# EAGLE design INA219x4_DoubleWing (EAGLE 9.4.2)
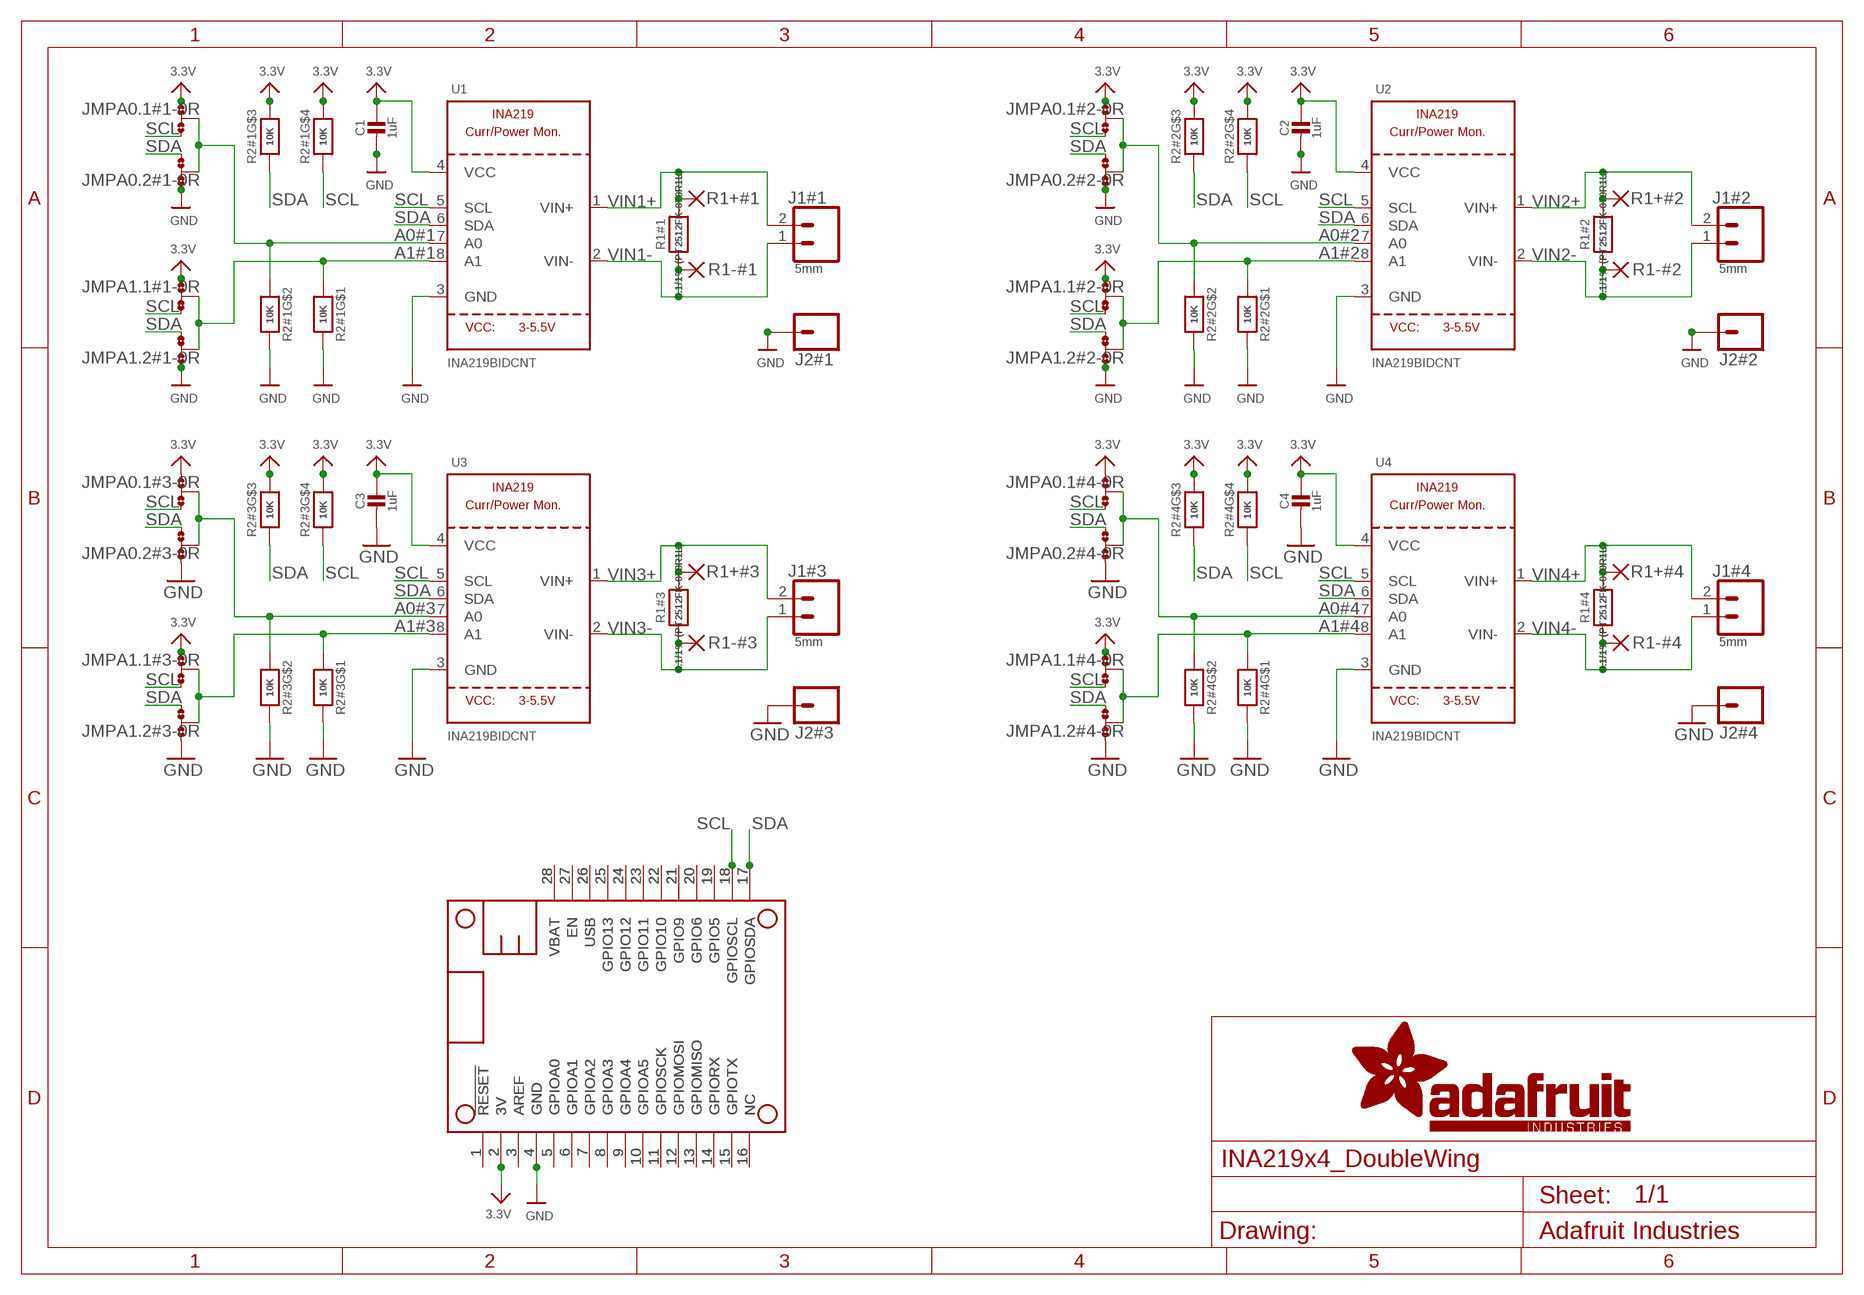
[diagram p0: schematic, sheet 1]

## Parts
C1  1uF  CAP_CERAMIC0805-NOOUTLINE  [0805-NO@1]
C2  1uF  CAP_CERAMIC0805-NOOUTLINE  [0805-NO@1]
C3  1uF  CAP_CERAMIC0805-NOOUTLINE  [0805-NO@1]
C4  1uF  CAP_CERAMIC0805-NOOUTLINE  [0805-NO@1]
J1#1  5mm  CONN_025MM  [SCREWTERMINAL-5MM-2]
J1#2  5mm  CONN_025MM  [SCREWTERMINAL-5MM-2]
J1#3  5mm  CONN_025MM  [SCREWTERMINAL-5MM-2]
J1#4  5mm  CONN_025MM  [SCREWTERMINAL-5MM-2]
J2#1  CONN_01  [1X01]
J2#2  CONN_01  [1X01]
J2#3  CONN_01  [1X01]
J2#4  CONN_01  [1X01]
JMPA0.1#1  0R-JUMPD  [C0R-JMP_NONE]
JMPA0.1#2  0R-JUMPD  [C0R-JMP_NONE]
JMPA0.1#3  0R-JUMPD  [C0R-JMP_NONE]
JMPA0.1#4  0R-JUMPD  [C0R-JMP_NONE]
JMPA0.2#1  0R-JUMPD  [C0R-JMP_NONE]
JMPA0.2#2  0R-JUMPD  [C0R-JMP_NONE]
JMPA0.2#3  0R-JUMPD  [C0R-JMP_NONE]
JMPA0.2#4  0R-JUMPD  [C0R-JMP_NONE]
JMPA1.1#1  0R-JUMPD  [C0R-JMP_NONE]
JMPA1.1#2  0R-JUMPD  [C0R-JMP_NONE]
JMPA1.1#3  0R-JUMPD  [C0R-JMP_NONE]
JMPA1.1#4  0R-JUMPD  [C0R-JMP_NONE]
JMPA1.2#1  0R-JUMPD  [C0R-JMP_NONE]
JMPA1.2#2  0R-JUMPD  [C0R-JMP_NONE]
JMPA1.2#3  0R-JUMPD  [C0R-JMP_NONE]
JMPA1.2#4  0R-JUMPD  [C0R-JMP_NONE]
MS1  FEATHERWING_NODIM  [FEATHERWING_DIM]
MS2  FEATHERWING_NODIM  [FEATHERWING_DIM]
R1#1  0.1/1% (PT2512FK-070R1L)  RESISTOR2512  [2512]
R1#2  0.1/1% (PT2512FK-070R1L)  RESISTOR2512  [2512]
R1#3  0.1/1% (PT2512FK-070R1L)  RESISTOR2512  [2512]
R1#4  0.1/1% (PT2512FK-070R1L)  RESISTOR2512  [2512]
R1+#1  1,6/0,9  [1,6/0,9]
R1+#2  1,6/0,9  [1,6/0,9]
R1+#3  1,6/0,9  [1,6/0,9]
R1+#4  1,6/0,9  [1,6/0,9]
R1-#1  1,6/0,9  [1,6/0,9]
R1-#2  1,6/0,9  [1,6/0,9]
R1-#3  1,6/0,9  [1,6/0,9]
R1-#4  1,6/0,9  [1,6/0,9]
R2#1  10K  RESISTOR_4PACK  [RESPACK_4X0603]
R2#2  10K  RESISTOR_4PACK  [RESPACK_4X0603]
R2#3  10K  RESISTOR_4PACK  [RESPACK_4X0603]
R2#4  10K  RESISTOR_4PACK  [RESPACK_4X0603]
U1  INA219BIDCNT  INA219  [SOT23-8]
U2  INA219BIDCNT  INA219  [SOT23-8]
U3  INA219BIDCNT  INA219  [SOT23-8]
U4  INA219BIDCNT  INA219  [SOT23-8]

## Nets
3.3V: C1.1 C2.1 C3.1 C4.1 JMPA0.1#1.1 JMPA0.1#2.1 JMPA0.1#3.1 JMPA0.1#4.1 JMPA1.1#1.1 JMPA1.1#2.1 JMPA1.1#3.1 JMPA1.1#4.1 MS1.2(3V) MS2.2(3V) R2#1.5 R2#1.6 R2#2.5 R2#2.6 R2#3.5 R2#3.6 R2#4.5 R2#4.6 U1.4(VCC) U2.4(VCC) U3.4(VCC) U4.4(VCC)
A0#1: JMPA0.1#1.2 JMPA0.2#1.2 R2#1.2 U1.7(A0)
A0#2: JMPA0.1#2.2 JMPA0.2#2.2 R2#2.2 U2.7(A0)
A0#3: JMPA0.1#3.2 JMPA0.2#3.2 R2#3.2 U3.7(A0)
A0#4: JMPA0.1#4.2 JMPA0.2#4.2 R2#4.2 U4.7(A0)
A1#1: JMPA1.1#1.2 JMPA1.2#1.2 R2#1.1 U1.8(A1)
A1#2: JMPA1.1#2.2 JMPA1.2#2.2 R2#2.1 U2.8(A1)
A1#3: JMPA1.1#3.2 JMPA1.2#3.2 R2#3.1 U3.8(A1)
A1#4: JMPA1.1#4.2 JMPA1.2#4.2 R2#4.1 U4.8(A1)
GND: C1.2 C2.2 C3.2 C4.2 J2#1.1 J2#2.1 J2#3.1 J2#4.1 JMPA0.2#1.3 JMPA0.2#2.3 JMPA0.2#3.3 JMPA0.2#4.3 JMPA1.2#1.3 JMPA1.2#2.3 JMPA1.2#3.3 JMPA1.2#4.3 MS1.4(GND) MS2.4(GND) R2#1.7 R2#1.8 R2#2.7 R2#2.8 R2#3.7 R2#3.8 R2#4.7 R2#4.8 U1.3(GND) U2.3(GND) U3.3(GND) U4.3(GND)
N$1: MS1.27(EN) MS2.27(EN)
N$2: MS1.16(NC) MS2.16(NC)
N$3: MS1.25(GPIO13) MS2.25(GPIO13)
N$4: MS1.15(GPIOTX) MS2.15(GPIOTX)
N$5: MS1.24(GPIO12) MS2.24(GPIO12)
N$6: MS1.14(GPIORX) MS2.14(GPIORX)
N$7: MS1.13(GPIOMISO) MS2.13(GPIOMISO)
N$8: MS1.12(GPIOMOSI) MS2.12(GPIOMOSI)
N$9: MS1.11(GPIOSCK) MS2.11(GPIOSCK)
N$10: MS1.10(GPIOA5) MS2.10(GPIOA5)
N$11: MS1.9(GPIOA4) MS2.9(GPIOA4)
N$12: MS1.8(GPIOA3) MS2.8(GPIOA3)
N$13: MS1.7(GPIOA2) MS2.7(GPIOA2)
N$14: MS1.6(GPIOA1) MS2.6(GPIOA1)
N$15: MS1.5(GPIOA0) MS2.5(GPIOA0)
N$17: MS1.3(AREF) MS2.3(AREF)
N$18: MS1.1(!RESET) MS2.1(!RESET)
N$19: MS1.23(GPIO11) MS2.23(GPIO11)
N$20: MS1.22(GPIO10) MS2.22(GPIO10)
N$21: MS1.21(GPIO9) MS2.21(GPIO9)
N$22: MS1.20(GPIO6) MS2.20(GPIO6)
N$23: MS1.19(GPIO5) MS2.19(GPIO5)
SCL: JMPA0.1#1.3 JMPA0.1#2.3 JMPA0.1#3.3 JMPA0.1#4.3 JMPA1.1#1.3 JMPA1.1#2.3 JMPA1.1#3.3 JMPA1.1#4.3 MS1.18(GPIOSCL) MS2.18(GPIOSCL) R2#1.4 R2#2.4 R2#3.4 R2#4.4 U1.5(SCL) U2.5(SCL) U3.5(SCL) U4.5(SCL)
SDA: JMPA0.2#1.1 JMPA0.2#2.1 JMPA0.2#3.1 JMPA0.2#4.1 JMPA1.2#1.1 JMPA1.2#2.1 JMPA1.2#3.1 JMPA1.2#4.1 MS1.17(GPIOSDA) MS2.17(GPIOSDA) R2#1.3 R2#2.3 R2#3.3 R2#4.3 U1.6(SDA) U2.6(SDA) U3.6(SDA) U4.6(SDA)
USB: MS1.26(USB) MS2.26(USB)
VBAT: MS1.28(VBAT) MS2.28(VBAT)
VIN1+: J1#1.2 R1#1.2 R1+#1.1(P) U1.1(VIN+)
VIN1-: J1#1.1 R1#1.1 R1-#1.1(P) U1.2(VIN-)
VIN2+: J1#2.2 R1#2.2 R1+#2.1(P) U2.1(VIN+)
VIN2-: J1#2.1 R1#2.1 R1-#2.1(P) U2.2(VIN-)
VIN3+: J1#3.2 R1#3.2 R1+#3.1(P) U3.1(VIN+)
VIN3-: J1#3.1 R1#3.1 R1-#3.1(P) U3.2(VIN-)
VIN4+: J1#4.2 R1#4.2 R1+#4.1(P) U4.1(VIN+)
VIN4-: J1#4.1 R1#4.1 R1-#4.1(P) U4.2(VIN-)

## Library data of the parts
C1-C4 = microbuilder:CAP_CERAMIC: Ceramic Capacitors For new designs, use the packages preceded by an '_' character since they are more reliable: The following footprints should be used on most boards: _0402 - Standard footprint for regular board layouts _0603 - Standard footprint for regular board layouts _0805 - Standard footprint for regular board layouts _1206 - Standard footprint for regular board layouts For extremely tight-pitch boards where space is at a premium, the following 'micro-pitch' footprints can be used (smaller pads, no silkscreen outline, etc.): _0402MP - Micro-pitch footprint for very dense/compact boards _0603MP - Micro-pitch footprint for very dense/compact boards _0805MP - Micro-pitch footprint for very dense/compact boards _1206MP - Micro-pitch footprint for very dense/compact boards
J1#1-J1#4 = SparkFun-Connectors:CONN_02: Multi connection point. Often used as Generic Header-pin footprint for 0.1 inch spaced/style header connections On any of the 0.1 inch spaced packages, you can populate with these: Break Away Headers - Straight <https://www.sparkfun.com/products/116> (PRT-00116) Break Away Male Headers - Right Angle <https://www.sparkfun.com/products/553> (PRT-00553) Female Headers <https://www.sparkfun.com/products/115> (PRT-00115) Break Away Headers - Machine Pin <https://www.sparkfun.com/products/117> (PRT-00117) Break Away Female Headers - Swiss Machine Pin <https://www.sparkfun.com/products/743> (PRT-00743) For SCREWTERMINALS and SPRING TERMINALS visit here: Screw Terimnals on SparkFun.com <https://www.sparkfun.com/search/results?term=Screw+Terminals> (5mm/3.5mm/2.54mm spacing) This device is also useful as a general connection point to wire up your design to another part of your project. Our various solder wires solder well into these plated through hole pads. Hook-Up Wire - Assortment (Stranded, 22 AWG) <https://www.sparkfun.com/products/11375> (PRT-11375) Hook-Up Wire - Assortment (Solid Core, 22 AWG) <https://www.sparkfun.com/products/11367> (PRT-11367) View the entire wire category on our website here <https://www.sparkfun.com/categories/141> Special notes: Molex polarized connector foot print use with: PRT-08233 with associated crimp pins and housings. 2.54_SCREWTERM for use with PRT-10571. 3.5mm Screw Terminal footprints for PRT-08084 5mm Screw Terminal footprints for use with PRT-08432; SF_SKU: PRT-08432
J2#1-J2#4 = SparkFun-Connectors:CONN_01: Single connection point. Often used as Generic Header-pin footprint for 0.1 inch spaced/style header connections On any of the 0.1 inch spaced packages, you can populate with these: Break Away Headers - Straight <https://www.sparkfun.com/products/116> (PRT-00116) Break Away Male Headers - Right Angle <https://www.sparkfun.com/products/553> (PRT-00553) Female Headers <https://www.sparkfun.com/products/115> (PRT-00115) Break Away Headers - Machine Pin <https://www.sparkfun.com/products/117> (PRT-00117) Break Away Female Headers - Swiss Machine Pin <https://www.sparkfun.com/products/743> (PRT-00743) This device is also useful as a general connection point to wire up your design to another part of your project. Our various solder wires solder well into these plated through hole pads. Hook-Up Wire - Assortment (Stranded, 22 AWG) <https://www.sparkfun.com/products/11375> (PRT-11375) Hook-Up Wire - Assortment (Solid Core, 22 AWG) <https://www.sparkfun.com/products/11367> (PRT-11367) View the entire wire category on our website here <https://www.sparkfun.com/categories/141> Special notes: SMTSO-256-ET is a "flush mount" nut for a 4-40 screw. We mostly use this on specialty testbeds; it is a nice way to connect hardware to your PCB at an adjustable hieght. Also note, the SNAP packages are for using a snappable style connector. We sell a baggie of snaps and they are also used on two LilyPad designs: Snap Assortment - 30 pack (male and female) <https://www.sparkfun.com/products/11347> (DEV-11347) LilyPad Arduino SimpleSnap <https://www.sparkfun.com/products/10941> (DEV-10941) LilyPad SimpleSnap Protoboard <https://www.sparkfun.com/products/10940> (DEV-10940)
JMPA0.1#1-JMPA0.1#4 JMPA0.2#1-JMPA0.2#4 JMPA1.1#1-JMPA1.1#4 JMPA1.2#1-JMPA1.2#4 = pv_jump-0r-smd:0R-JUMP: SMD 0R 0805 Jumper
MS1 MS2 = microbuilder:FEATHERWING
R1#1-R1#4 = microbuilder:RESISTOR: Resistors For new designs, use the packages preceded by an '_' character since they are more reliable: The following footprints should be used on most boards: _0402 - Standard footprint for regular board layouts _0603 - Standard footprint for regular board layouts _0805 - Standard footprint for regular board layouts _1206 - Standard footprint for regular board layouts For extremely tight-pitch boards where space is at a premium, the following 'micro-pitch' footprints can be used (smaller pads, no silkscreen outline, etc.): _0402MP - Micro-pitch footprint for very dense/compact boards _0603MP - Micro-pitch footprint for very dense/compact boards _0805MP - Micro-pitch footprint for very dense/compact boards _1206MP - Micro-pitch footprint for very dense/compact boards
R1+#1-R1+#4 R1-#1-R1-#4 = wirepad:1,6/0,9: THROUGH-HOLE PAD
R2#1-R2#4 = microbuilder:RESISTOR_4PACK: Resistor Packs (4 resistors) 4 x 0603 10K 1/16W - Digikey: YC164J-10KCT-ND
U1-U4 = microbuilder:INA219: INA219 - I2C Current/Power Monitor Voltage Range: 0-26V Accuracy: 0.5% Temperature: -40°C - 125°C

## Board
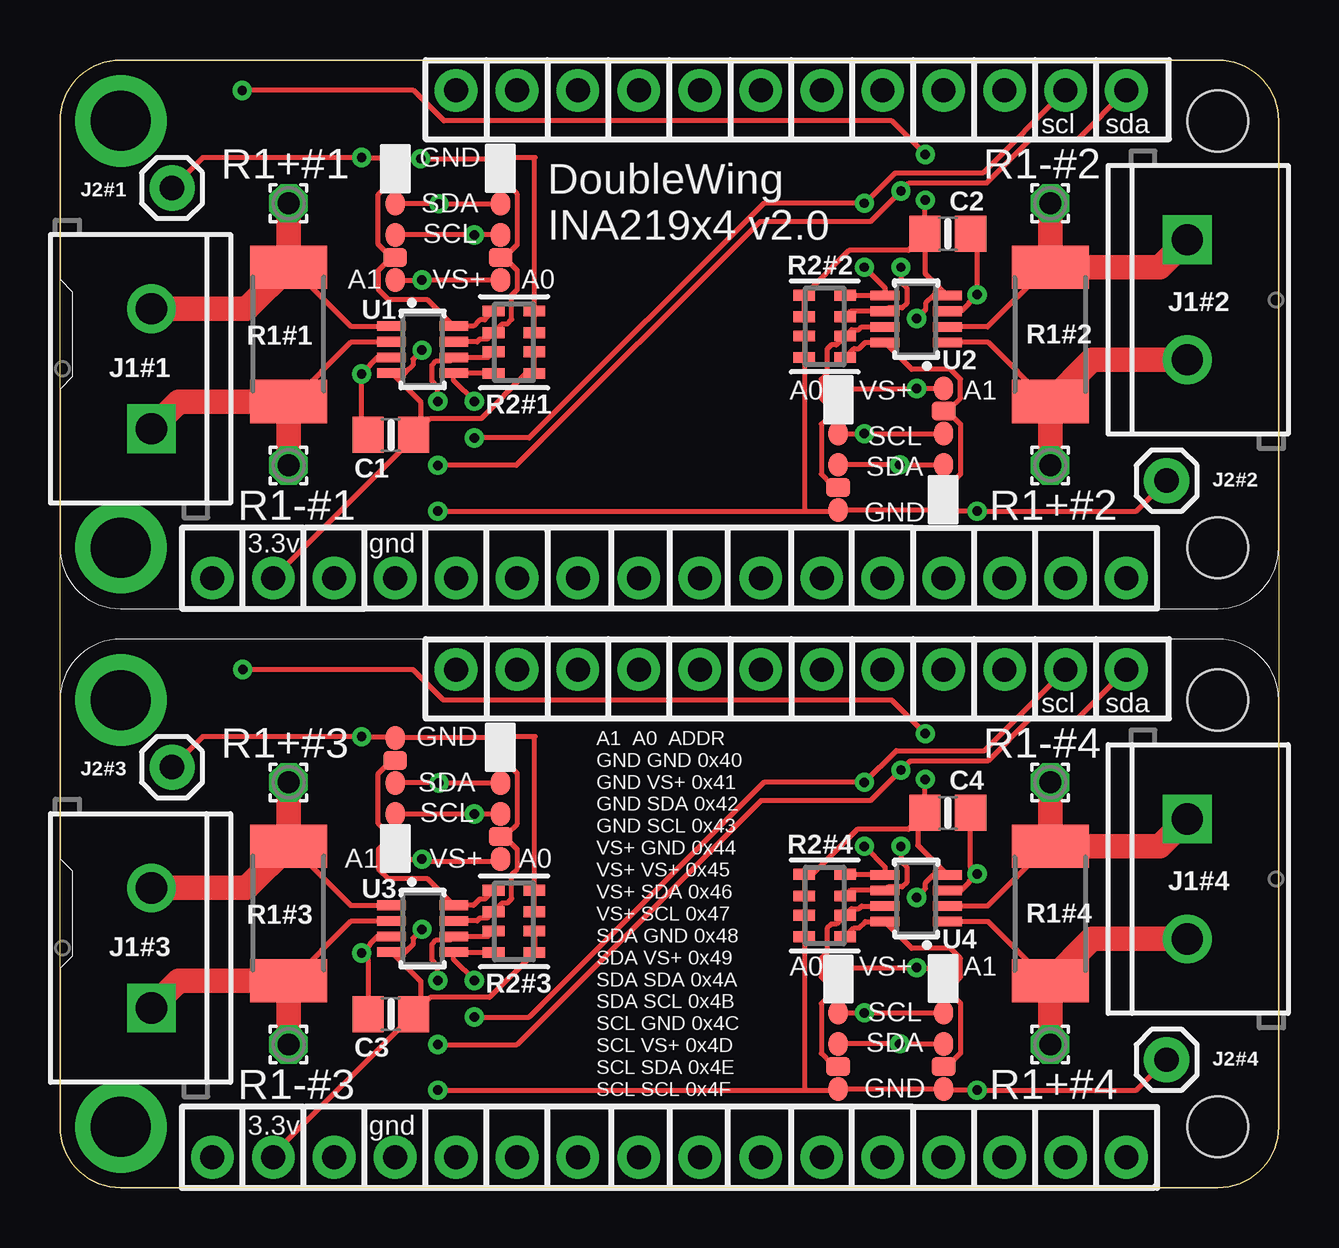
[diagram p1: board, top side]
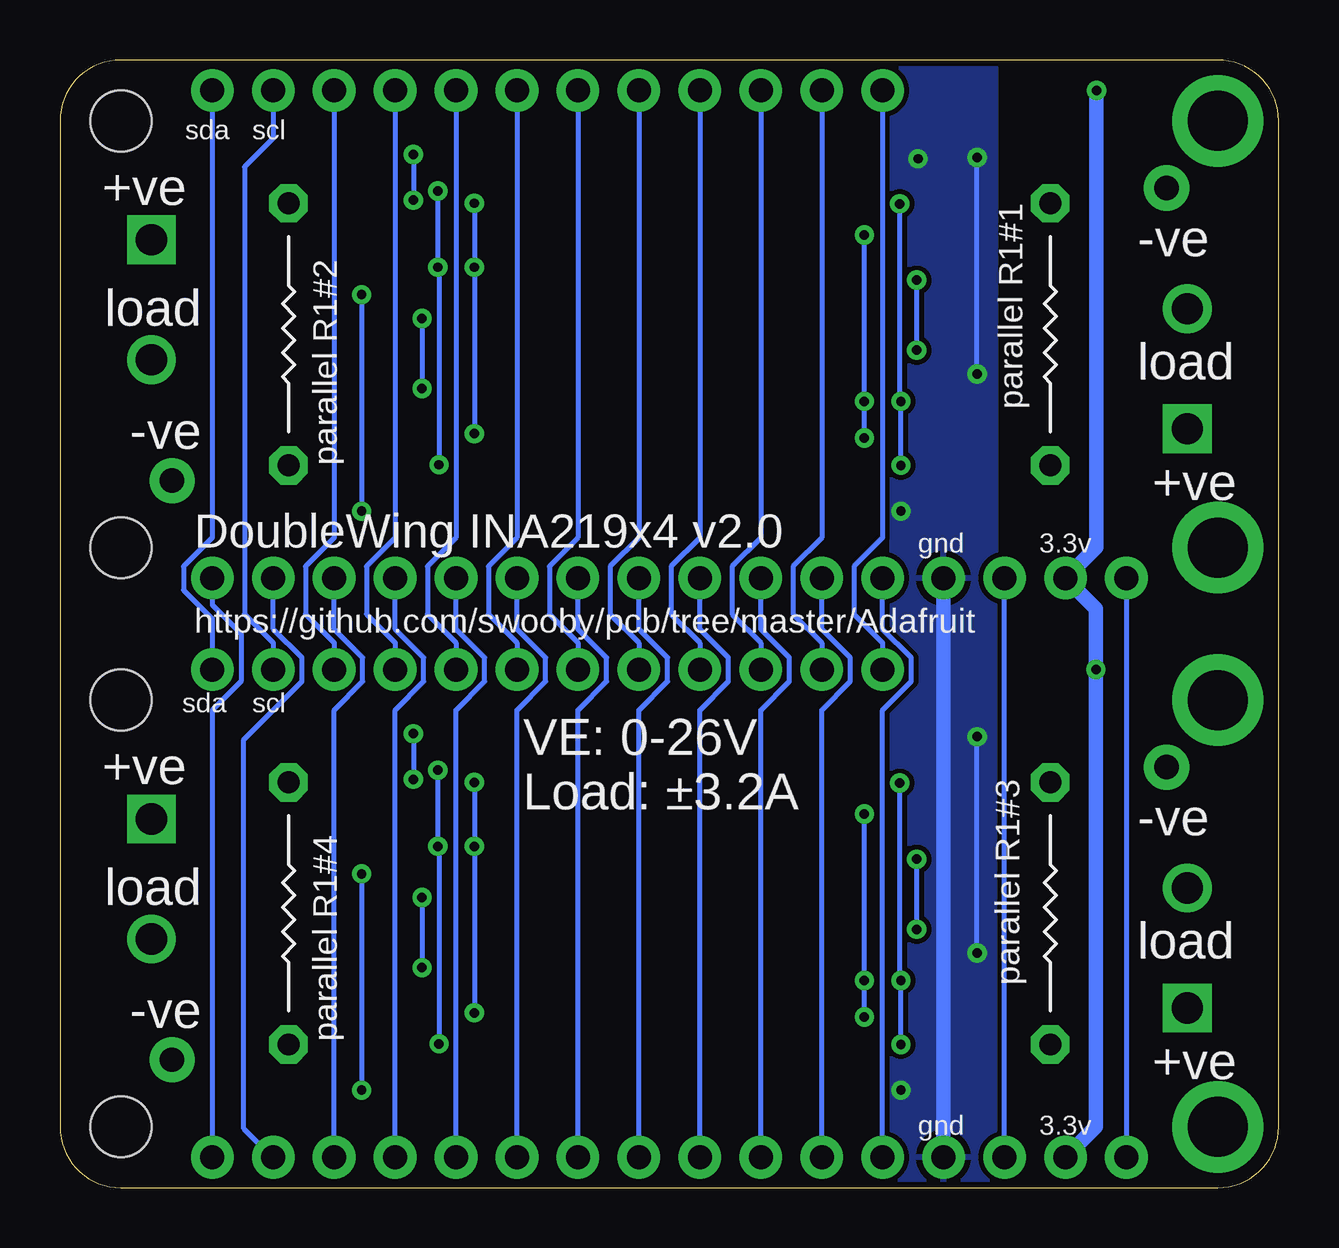
[diagram p2: board, bottom side, seen from below]

Size 50.8 x 46.99 mm. Coordinates in mm from the lower left corner, seen from the top.
Outline: 2.54,46.99 48.26,46.99 arc-90 50.8,44.45 50.8,2.54 arc-90 48.26,0 2.54,0 arc-90 0,2.54 0,44.45 arc-90 2.54,46.99
Copper layers (1*16): Top 0.035mm / dielectric 1.5mm / Bottom 0.035mm
Design rules "adafruit": minimum track width 8mil, minimum drill 15.5mil, track to track 8mil, track to pad 8mil, pad to pad 8mil, via to via 8mil, smd to smd 8mil, copper to edge 10mil, drill to drill 8mil, minimum pad ring 10mil, minimum via ring 8mil, stop-mask expansion 2mil, vias tented up to drill 20mil, thermal gap 10mil

### Footprints (pad centres in the part's own frame; a part is rotated, then mirrored left to right if it is on the bottom)
0805-NO@1 = smd 1.3 x 1.5: 1 -0.95,0; 2 0.95,0
SCREWTERMINAL-5MM-2 = drill 1.3 pad 2.032 square: 1 0,0 | drill 1.3 pad 2.032: 2 5,0
1X01 = drill 1.016 pad 1.88: 1 0,0
C0R-JMP_NONE = smd 0.8 x 1: 1 0,0.938; 3 0,-0.938 | smd 1 x 0.8: 2 0,0
FEATHERWING_DIM = drill 1 pad 1.778: 1 6.35,1.27; 2 8.89,1.27; 3 11.43,1.27; 4 13.97,1.27; 5 16.51,1.27; 6 19.05,1.27; 7 21.59,1.27; 8 24.13,1.27; 9 26.67,1.27; 10 29.21,1.27; 11 31.75,1.27; 12 34.29,1.27; 13 36.83,1.27; 14 39.37,1.27; 15 41.91,1.27; 16 44.45,1.27; 17 44.45,21.59; 18 41.91,21.59; 19 39.37,21.59; 20 36.83,21.59; 21 34.29,21.59; 22 31.75,21.59; 23 29.21,21.59; 24 26.67,21.59; 25 24.13,21.59; 26 21.59,21.59; 27 19.05,21.59; 28 16.51,21.59 | drill 2.5 pad 3.81: P$1 2.54,20.32; P$2 2.54,2.54 | hole 2.54: 48.26,20.32; 48.26,2.54
2512 = smd 1.8 x 3.2: 1 -2.8,0; 2 2.8,0
1,6/0,9 = drill 0.914 pad 1.6 octagon: 1 0,0
RESPACK_4X0603 = smd 0.45 x 0.9: 1 -1.3,-0.85; 2 -0.4,-0.85; 3 0.4,-0.85; 4 1.3,-0.85; 5 1.3,0.85; 6 0.4,0.85; 7 -0.4,0.85; 8 -1.3,0.85
SOT23-8 = smd 0.4 x 1.2: 1 -0.975,-1.3; 2 -0.325,-1.3; 3 0.325,-1.3; 4 0.975,-1.3; 5 0.975,1.3; 6 0.325,1.3; 7 -0.325,1.3; 8 -0.975,1.3

### Placement (x,y rotation side)
C1  13.79,31.37 180 top
C2  37.01,39.75 0 top
C3  13.79,7.24 180 top
C4  37.01,15.62 0 top
J1#1  3.81,31.62 90 top
J1#2  46.99,39.5 270 top
J1#3  3.81,7.49 90 top
J1#4  46.99,15.37 270 top
J2#1  4.67,41.66 180 top
J2#2  46.13,29.46 0 top
J2#3  4.67,17.53 180 top
J2#4  46.13,5.33 0 top
JMPA0.1#1  18.36,38.76 180 top
JMPA0.1#2  32.44,32.36 0 top
JMPA0.1#3  18.36,14.63 180 top
JMPA0.1#4  32.44,8.23 0 top
JMPA0.2#1  18.36,41.94 180 top
JMPA0.2#2  32.44,29.18 0 top
JMPA0.2#3  18.36,17.81 180 top
JMPA0.2#4  32.44,5.05 0 top
JMPA1.1#1  13.97,38.76 180 top
JMPA1.1#2  36.83,32.36 0 top
JMPA1.1#3  13.97,14.63 180 top
JMPA1.1#4  36.83,8.23 0 top
JMPA1.2#1  13.97,41.94 180 top
JMPA1.2#2  36.83,29.18 0 top
JMPA1.2#3  13.97,17.81 180 top
JMPA1.2#4  36.83,5.05 0 top
MS1  0,0 0 top
MS2  0,24.13 0 top
R1#1  9.53,35.56 90 top
R1#2  41.27,35.56 270 top
R1#3  9.53,11.43 90 top
R1#4  41.27,11.43 270 top
R1+#1  9.53,41.02 180 top
R1+#2  41.27,30.1 0 top
R1+#3  9.53,16.89 180 top
R1+#4  41.27,5.97 0 top
R1-#1  9.53,30.1 180 top
R1-#2  41.27,41.02 0 top
R1-#3  9.53,5.97 180 top
R1-#4  41.27,16.89 0 top
R2#1  18.92,35.23 270 top
R2#2  31.88,35.89 90 top
R2#3  18.92,11.1 270 top
R2#4  31.88,11.76 90 top
U1  15.11,34.92 270 top
U2  35.69,36.2 90 top
U3  15.11,10.79 270 top
U4  35.69,12.06 90 top

### Tracks (layer width: path | path; a pad name or v marks a point on that pad's centre or on a via)
3.3V  (via drill 0.39)
  Top 0.203: v7.59,45.72 14.73,45.72 16,44.45 34.67,44.45 v36.07,43.05 | v7.62,21.59 14.71,21.59 15.98,20.32 34.67,20.32 v36.07,18.92 | v15.09,34.9 14.72,34.53 14.72,34.27 14.39,33.95 U1.4 15.04,32.72 15.04,31.67 C1.1 | C1.1 15.43,32.06 17.56,32.06 19.43,33.93 19.51,33.93 19.71,33.93 R2#1.5 R2#1.6 | C2.1 36.06,41.14 v36.07,41.15 | JMPA1.1#1.1 v15.09,37.82 | v15.09,37.82 | JMPA0.1#1.1 v15.09,37.82 | JMPA0.1#2.1 v35.71,33.3 | v35.71,33.3 | JMPA1.1#2.1 v35.71,33.3 | C1.1 14.74,31.25 MS2.2 | v15.09,10.77 14.72,10.4 14.72,10.14 14.39,9.82 U3.4 15.04,8.59 15.04,7.54 C3.1 | C3.1 15.43,7.93 17.9,7.93 R2#3.5 R2#3.6 | JMPA1.1#3.1 v15.09,13.69 15.24,13.61 18.29,13.61 JMPA0.1#3.1 | C3.1 8.89,1.39 MS1.2 | R2#4.6 R2#4.5 31.37,13.06 33.24,14.93 35.37,14.93 C4.1 | v35.71,12.09 36.08,12.46 36.08,12.72 36.41,13.04 U4.4 35.76,14.27 35.76,15.32 C4.1 | C4.1 36.06,17.01 v36.07,17.02 | JMPA0.1#4.1 32.51,9.14 35.56,9.14 v35.71,9.17 35.76,9.14 36.78,9.14 JMPA1.1#4.1 | R2#2.6 R2#2.5 32.9,39.06 35.37,39.06 C2.1 | C2.1 36.06,38.1 U2.4 36.41,37.17 36.08,36.85 36.08,36.59 v35.71,36.22
  Bottom 0.203: v15.09,34.9 v15.09,37.82 | v36.07,43.05 v36.07,41.15 | v35.71,36.22 v35.71,33.3 | v15.09,10.77 v15.09,13.69 | v36.07,18.92 v36.07,17.02 | v35.71,12.09 v35.71,9.17
  Bottom 0.61: v7.59,45.72 7.59,26.7 MS2.2 7.62,24.13 v7.62,21.59 7.62,2.54 MS1.2
A0#1
  Top 0.203: JMPA0.2#1.2 18.5,41.8 18.66,41.8 19.07,41.39 19.07,39.31 18.66,38.89 18.5,38.89 JMPA0.1#1.2 18.69,38.81 18.69,38.61 18.68,38.6 19.07,38.21 19.07,37.43 18.83,37.19 18.83,36.18 18.65,36 18.44,36 R2#1.2 17.8,35.36 17.5,35.36 17.39,35.25 U1.7
A0#2
  Top 0.203: JMPA0.2#2.2 32.3,29.32 32.14,29.32 31.73,29.73 31.73,31.81 32.14,32.23 32.3,32.23 JMPA0.1#2.2 32.11,32.31 32.11,32.51 32.14,32.49 31.73,32.91 31.73,33.69 31.97,33.93 31.97,34.94 32.15,35.12 32.36,35.12 R2#2.2 33,35.76 33.3,35.76 33.41,35.87 U2.7
A0#3
  Top 0.203: JMPA0.2#3.2 18.5,17.67 18.66,17.67 19.07,17.26 19.07,15.18 18.66,14.76 18.5,14.76 JMPA0.1#3.2 18.49,14.63 18.69,14.43 18.71,14.44 19.07,14.08 19.07,13.3 18.83,13.06 18.83,12.05 18.65,11.87 18.44,11.87 R2#3.2 17.8,11.23 17.5,11.23 17.39,11.12 U3.7
A0#4
  Top 0.203: JMPA0.2#4.2 32.3,5.19 32.14,5.19 31.73,5.6 31.73,7.68 32.14,8.1 32.3,8.1 JMPA0.1#4.2 32.31,8.33 32.3,8.36 32.14,8.36 31.73,8.78 31.73,9.56 31.97,9.8 31.97,10.81 32.15,10.99 32.36,10.99 R2#4.2 33,11.63 33.3,11.63 33.41,11.74 U4.7
A1#1
  Top 0.203: R2#1.1 17.7,36.16 17.5,36.16 17.24,35.9 U1.8 15.29,37.02 13.68,37.02 13.27,37.43 13.27,38.21 13.68,38.63 13.84,38.63 JMPA1.1#1.2 13.84,38.89 13.68,38.89 13.27,39.31 13.27,41.39 13.68,41.8 13.84,41.8 JMPA1.2#1.2
A1#2
  Top 0.203: R2#2.1 33.1,34.96 33.3,34.96 33.56,35.22 U2.8 35.51,34.1 37.12,34.1 37.53,33.69 37.53,32.91 37.12,32.49 36.96,32.49 JMPA1.1#2.2 36.96,32.23 37.12,32.23 37.53,31.81 37.53,29.73 37.12,29.32 36.96,29.32 JMPA1.2#2.2
A1#3
  Top 0.203: R2#3.1 17.7,12.03 17.5,12.03 17.24,11.77 U3.8 15.29,12.89 13.68,12.89 13.27,13.3 13.27,14.08 13.68,14.5 13.84,14.5 JMPA1.1#3.2 13.84,14.76 13.68,14.76 13.27,15.18 13.27,17.26 13.68,17.67 13.84,17.67 JMPA1.2#3.2
A1#4
  Top 0.203: R2#4.1 33.1,10.83 33.3,10.83 33.56,11.09 U4.8 35.51,9.97 37.12,9.97 37.53,9.56 37.53,8.78 37.12,8.36 36.96,8.36 JMPA1.1#4.2 36.96,8.1 37.12,8.1 37.53,7.68 37.53,5.6 37.12,5.19 36.96,5.19 JMPA1.2#4.2
GND  (via drill 0.39)
  Top 0.203: J2#1.1 5.94,42.93 v12.57,42.93 13.92,42.93 | 13.23,34.6 13.19,34.56 | 13.19,34.56 12.91,34.28 12.91,34.24 v12.57,33.91 12.57,31.64 C1.2 | 30.99,28.19 32.31,28.19 32.31,28.25 JMPA0.2#2.3 JMPA1.2#2.3 36.88,28.19 v38.23,28.19 44.86,28.19 J2#2.1 | 30.99,28.19 31.03,28.23 R2#2.8 R2#2.7 | C2.2 38.23,39.48 v38.23,37.21 37.89,36.88 37.89,36.84 37.61,36.56 37.59,36.58 37.19,36.58 U2.3 | JMPA1.2#1.3 v15.04,42.87 | v15.04,42.87 JMPA0.2#1.3 18.49,42.88 18.49,42.93 19.81,42.93 19.77,42.89 R2#1.8 R2#1.7 | v15.75,28.19 30.99,28.19 | J2#3.1 5.94,18.8 v12.57,18.8 13.92,18.8 JMPA1.2#3.3 JMPA0.2#3.3 18.42,18.8 19.81,18.8 19.77,18.76 R2#3.8 R2#3.7 | C3.2 12.84,9.51 v12.57,9.78 12.91,10.11 12.91,10.15 13.23,10.47 U3.3 | J2#4.1 44.86,4.06 v38.23,4.06 36.88,4.06 JMPA1.2#4.3 JMPA0.2#4.3 32.38,4.06 30.99,4.06 | C4.2 37.96,13.35 v38.23,13.08 37.89,12.75 37.89,12.71 37.57,12.39 U4.3 | R2#4.7 R2#4.8 31.03,4.1 30.99,4.06 | v15.75,4.06 30.99,4.06 | U1.3 13.61,34.54 13.21,34.54 13.19,34.56 | v15.04,42.88 v15.04,42.87
  Bottom 0.203: v12.57,33.91 v12.57,42.93 | v38.23,37.21 v38.23,28.19 | v12.57,9.78 v12.57,18.8 | v38.23,13.08 v38.23,4.06
  Bottom 0.61: MS2.4 MS1.4
  pour Bottom: 16.13,46.74 11.81,46.74 11.81,0.25 16.13,0.25
N$1
  Bottom 0.203: MS1.27 19.05,22.7 20.24,23.9 20.24,25.89 19.05,27.09 MS2.27
N$2
  Bottom 0.203: MS2.16 44.45,24.29 43.26,23.09 43.26,21.1 44.45,19.9 MS1.16
N$3
  Bottom 0.203: MS1.25 24.13,22.7 25.32,23.9 25.32,25.89 24.13,27.09 MS2.25
N$4
  Bottom 0.203: MS1.15 41.95,1.27 43.14,2.46 43.14,18.67 40.72,21.1 40.72,22.08 41.91,23.28 MS2.15
N$5
  Bottom 0.203: MS1.24 26.67,22.7 27.86,23.9 27.86,25.89 26.67,27.09 MS2.24
N$6
  Bottom 0.203: MS1.14 39.37,19.9 38.18,21.1 38.18,22.08 39.37,23.28 MS2.14
N$7
  Bottom 0.203: MS1.13 36.83,19.9 35.64,21.1 35.64,22.08 36.83,23.28 MS2.13
N$8
  Bottom 0.203: MS1.12 34.29,19.9 33.1,21.1 33.1,22.08 34.29,23.28 MS2.12
N$9
  Bottom 0.203: MS1.11 31.75,19.9 30.56,21.1 30.56,22.08 31.75,23.28 MS2.11
N$10
  Bottom 0.203: MS1.10 29.21,19.9 28.02,21.1 28.02,22.08 29.21,23.28 MS2.10
N$11
  Bottom 0.203: MS1.9 26.67,19.9 25.48,21.1 25.48,22.08 26.67,23.28 MS2.9
N$12
  Bottom 0.203: MS1.8 24.13,19.9 22.94,21.1 22.94,22.08 24.13,23.28 MS2.8
N$13
  Bottom 0.203: MS1.7 21.59,19.9 20.4,21.1 20.4,22.08 21.59,23.28 MS2.7
N$14
  Bottom 0.203: MS1.6 19.05,19.9 17.86,21.1 17.86,22.08 19.05,23.28 MS2.6
N$15
  Bottom 0.203: MS1.5 16.51,19.9 15.32,21.1 15.32,22.08 16.51,23.28 MS2.5
N$17
  Bottom 0.203: MS1.3 MS2.3
N$18
  Bottom 0.203: MS2.1 MS1.1
N$19
  Bottom 0.203: MS1.23 29.21,22.7 30.4,23.9 30.4,25.89 29.21,27.09 MS2.23
N$20
  Bottom 0.203: MS1.22 31.75,22.7 32.94,23.9 32.94,25.89 31.75,27.09 MS2.22
N$21
  Bottom 0.203: MS1.21 34.29,22.7 35.48,23.9 35.48,25.89 34.29,27.09 MS2.21
N$22
  Bottom 0.203: MS1.20 36.83,22.7 38.02,23.9 38.02,25.89 36.83,27.09 MS2.20
N$23
  Bottom 0.203: MS1.19 39.37,22.7 40.56,23.9 40.56,25.89 39.37,27.09 MS2.19
SCL  (via drill 0.39)
  Top 0.203: v17.27,32.77 16.41,33.62 U1.5 18.05,33.95 R2#1.4 | JMPA0.1#1.3 v17.27,39.7 JMPA1.1#1.3 | v33.53,38.35 34.39,37.49 U2.5 32.75,37.17 R2#2.4 | JMPA0.1#2.3 v33.53,31.42 JMPA1.1#2.3 | MS2.18 38.47,42.28 34.8,42.28 33.55,41.02 v33.53,41.02 29.34,41.02 19.56,31.24 v17.27,31.24 | v17.27,8.64 16.41,9.49 U3.5 18.05,9.82 R2#3.4 | JMPA0.1#3.3 v17.27,15.57 JMPA1.1#3.3 | v33.53,14.22 34.39,13.37 U4.5 32.75,13.04 32.72,13.01 R2#4.4 | JMPA0.1#4.3 v33.53,7.29 JMPA1.1#4.3 | MS1.18 38.54,18.22 34.85,18.22 v33.53,16.89 29.34,16.89 19.56,7.11 v17.27,7.11
  Bottom 0.203: MS1.18 41.91,22.7 43.1,23.9 43.1,42.53 41.91,43.73 MS2.18 | v17.27,31.24 v17.27,32.77 v17.27,39.7 | v33.53,41.02 v33.53,38.35 v33.53,31.42 | v17.27,7.11 v17.27,8.64 v17.27,15.57 | v33.53,16.89 v33.53,14.22 v33.53,7.29
SDA  (via drill 0.39)
  Top 0.203: v15.75,32.77 15.75,33.38 15.51,33.62 15.51,34.28 15.69,34.45 16.27,34.45 U1.6 17.84,34.6 R2#1.3 | JMPA1.2#1.1 v15.8,41 JMPA0.2#1.1 | v35.05,38.35 35.05,37.74 35.29,37.5 35.29,36.84 35.11,36.66 34.53,36.66 U2.6 32.96,36.52 R2#2.3 | JMPA1.2#2.1 v35,30.12 JMPA0.2#2.1 | MS2.17 42.42,43.69 40.45,43.69 38.64,41.87 35.4,41.87 v35.05,41.53 33.78,40.26 29.18,40.26 19.02,30.1 v15.75,30.1 | v15.75,8.64 15.75,9.25 15.51,9.49 15.51,10.15 15.69,10.32 16.27,10.32 U3.6 17.84,10.47 R2#3.3 | JMPA1.2#3.1 v15.8,16.87 JMPA0.2#3.1 | v35.05,14.22 35.05,13.61 35.29,13.37 35.29,12.71 35.11,12.54 34.53,12.54 U4.6 32.96,12.39 R2#4.3 | JMPA1.2#4.1 v35,5.99 JMPA0.2#4.1 | MS1.17 42.42,19.56 40.45,19.56 38.67,17.78 35.43,17.78 v35.05,17.4 33.78,16.13 29.21,16.13 19.05,5.97 v15.75,5.97
  Bottom 0.203: MS1.17 44.45,23.71 45.64,24.91 45.64,25.89 44.45,27.09 MS2.17 | v15.75,30.1 v15.75,32.77 15.8,32.82 v15.8,41 | v35.05,41.53 v35.05,38.35 35,38.3 v35,30.12 | v15.75,5.97 v15.75,8.64 15.8,8.69 v15.8,16.87 | v35.05,17.4 v35.05,14.22 35,14.17 v35,5.99
USB
  Bottom 0.203: MS1.26 21.59,22.7 22.78,23.9 22.78,25.89 21.59,27.09 MS2.26
VBAT
  Bottom 0.203: MS1.28 16.51,22.7 17.7,23.9 17.7,25.89 16.51,27.09 MS2.28
VIN1+
  Top 0.203: R1#1.2 9.65,38.36 12.11,35.9 U1.1
  Top 1.016: R1+#1.1 R1#1.2 7.79,36.62 J1#1.2
VIN1-
  Top 0.203: R1#1.1 9.65,32.76 12.14,35.25 U1.2
  Top 1.016: R1-#1.1 R1#1.1 4.95,32.76 J1#1.1
VIN2+
  Top 0.203: R1#2.2 41.15,32.76 38.69,35.22 U2.1
  Top 1.016: R1+#2.1 R1#2.2 43.01,34.5 J1#2.2
VIN2-
  Top 0.203: R1#2.1 41.15,38.36 38.66,35.87 U2.2
  Top 1.016: R1-#2.1 R1#2.1 45.85,38.36 J1#2.1
VIN3+
  Top 0.203: R1#3.2 9.65,14.23 12.11,11.77 U3.1
  Top 1.016: R1+#3.1 R1#3.2 7.79,12.49 J1#3.2
VIN3-
  Top 0.203: R1#3.1 9.65,8.63 12.14,11.12 U3.2
  Top 1.016: R1-#3.1 R1#3.1 4.95,8.63 J1#3.1
VIN4+
  Top 0.203: R1#4.2 41.15,8.63 38.69,11.09 U4.1
  Top 1.016: R1+#4.1 R1#4.2 43.01,10.37 J1#4.2
VIN4-
  Top 0.203: R1#4.1 41.15,14.23 38.66,11.74 U4.2
  Top 1.016: R1-#4.1 R1#4.1 45.85,14.23 J1#4.1

### Text on the board
tPlace: scl | sda | GND | DoubleWing / INA219x4 v2.0 | SDA | SCL | A1 | VS+ | A0 | A0 | VS+ | A1 | SCL | SDA | GND | 3.3v | gnd | scl | sda | GND | SDA | SCL | A1 | VS+ | A0 | A0 | VS+ | A1 | SCL | SDA | GND | A1 A0 ADDR / GND GND 0x40 / GND VS+ 0x41 / GND SDA 0x42 / GND SCL 0x43 / VS+ GND 0x44 / VS+ VS+ 0x45 / VS+ SDA 0x46 / VS+ SCL 0x47 / SDA GND 0x48 / SDA VS+ 0x49 / SDA SDA 0x4A / SDA SCL 0x4B / SCL GND 0x4C / SCL VS+ 0x4D / SCL SDA 0x4E / SCL SCL 0x4F | 3.3v | gnd
bPlace: scl | sda | parallel R1#1 | +ve | -ve | load | load | -ve | +ve | parallel R1#2 | DoubleWing INA219x4 v2.0 | 3.3v | gnd | https://github.com/swooby/pcb/tree/master/Adafruit | scl | sda | parallel R1#3 | +ve | -ve | VE: 0-26V / Load: ±3.2A | load | load | -ve | +ve | parallel R1#4 | 3.3v | gnd